# EAGLE design device (EAGLE 9.5.1)
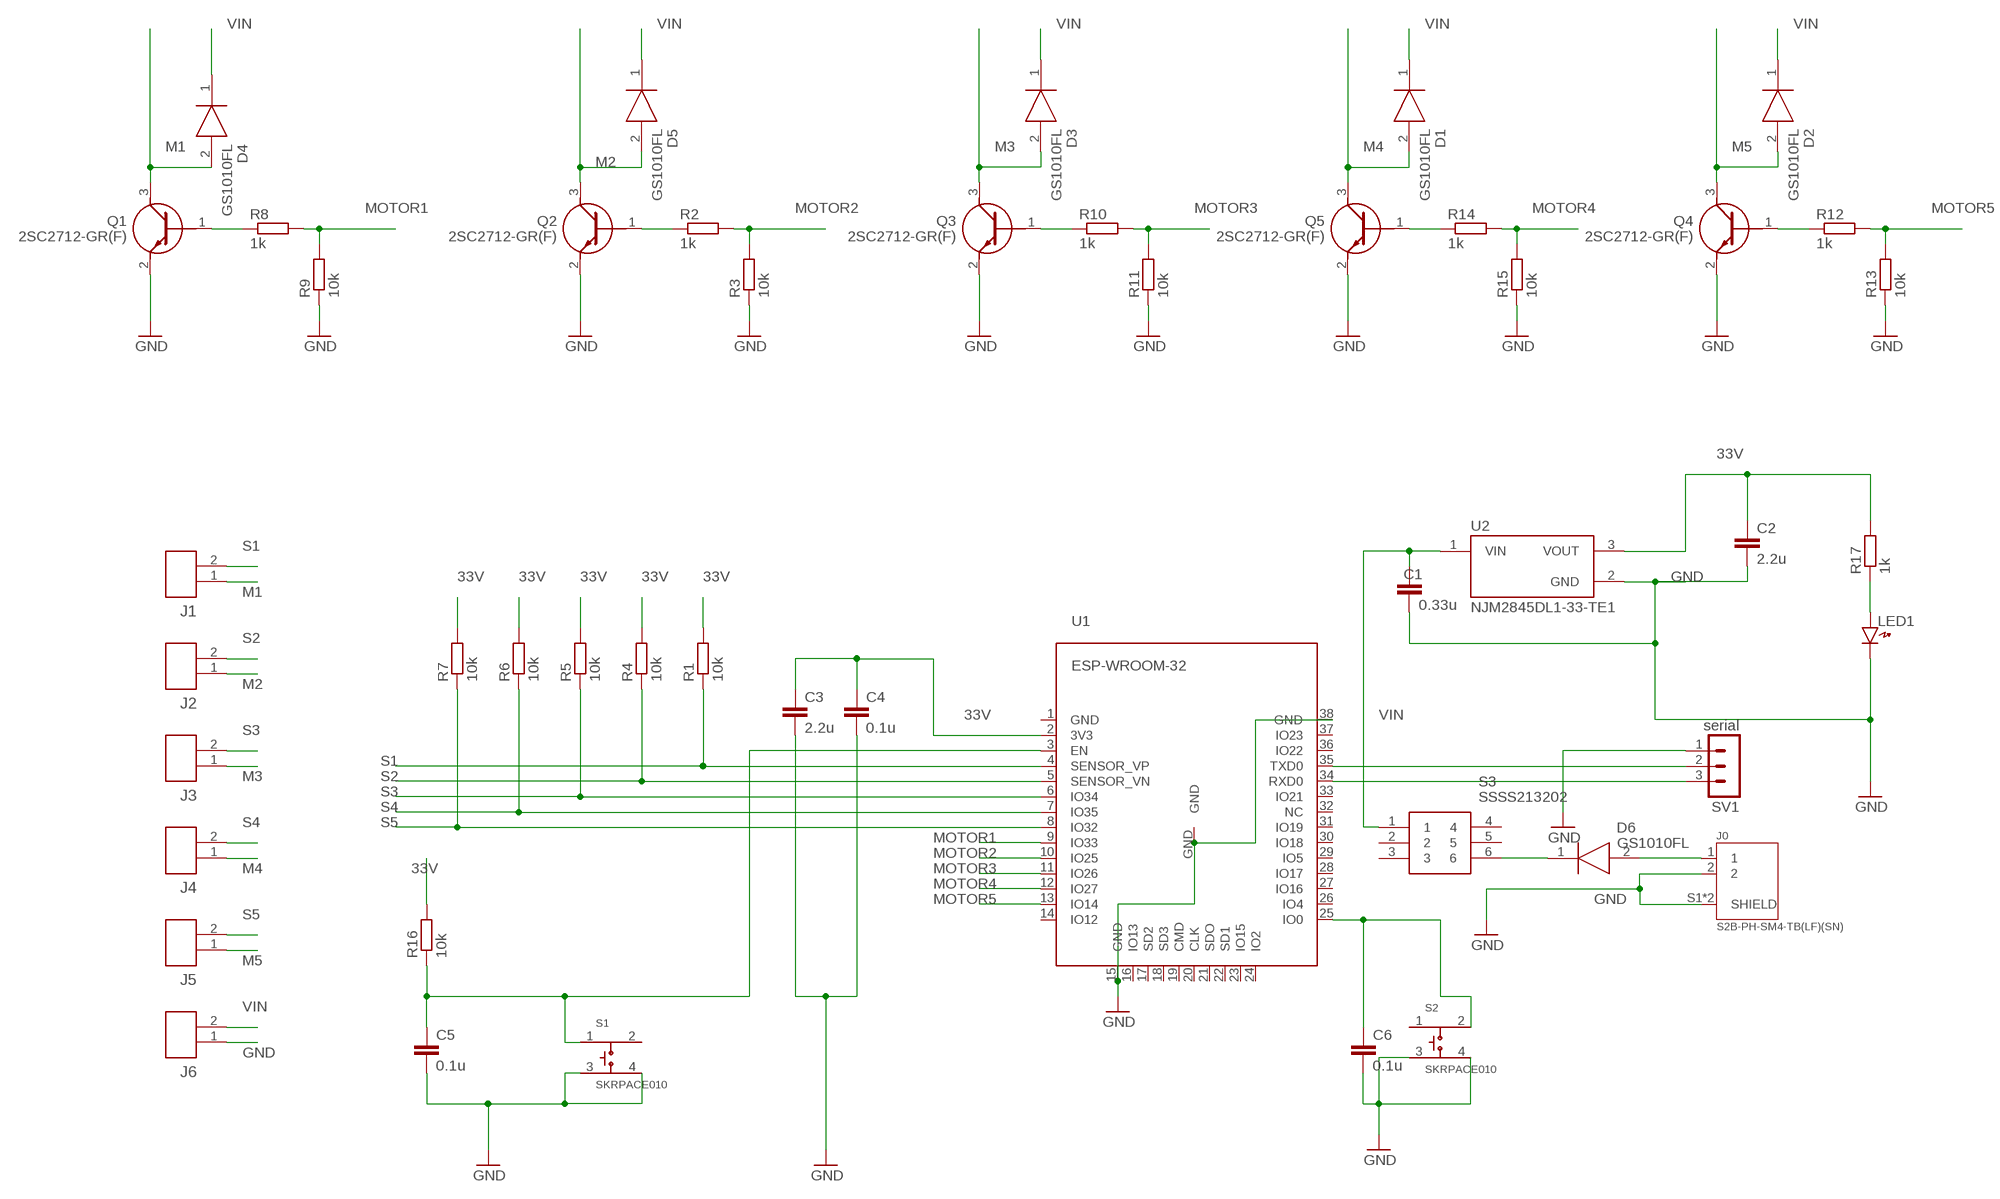
[diagram p0: schematic, sheet 1]

## Parts
C1  0.33u  C-EU025-024X044  [C025-024X044]
C2  2.2u  C-EUC0402  [C0402]
C3  2.2u  C-EUC0402  [C0402]
C4  0.1u  C-EUC0402  [C0402]
C5  0.1u  C-EUC0402  [C0402]
C6  0.1u  C-EUC0402  [C0402]
D1  GS1010FL  [SODFL3618X110N]
D2  GS1010FL  [SODFL3618X110N]
D3  GS1010FL  [SODFL3618X110N]
D4  GS1010FL  [SODFL3618X110N]
D5  GS1010FL  [SODFL3618X110N]
D6  GS1010FL  [SODFL3618X110N]
J0  S2B-PH-SM4-TB(LF)(SN)  [JST_S2B-PH-SM4-TB(LF)(SN)]
J1  JST_ZH_2PIN  [JST_ZH_2PIN]
J2  JST_ZH_2PIN  [JST_ZH_2PIN]
J3  JST_ZH_2PIN  [JST_ZH_2PIN]
J4  JST_ZH_2PIN  [JST_ZH_2PIN]
J5  JST_ZH_2PIN  [JST_ZH_2PIN]
J6  JST_ZH_2PIN  [JST_ZH_2PIN]
LED1  LED1608  [LED1608]
Q1  2SC2712-GR(F)  [SC-59]
Q2  2SC2712-GR(F)  [SC-59]
Q3  2SC2712-GR(F)  [SC-59]
Q4  2SC2712-GR(F)  [SC-59]
Q5  2SC2712-GR(F)  [SC-59]
R1  10k  R-EU_R0603  [R0603]
R2  1k  R-EU_R0603  [R0603]
R3  10k  R-EU_R0603  [R0603]
R4  10k  R-EU_R0603  [R0603]
R5  10k  R-EU_R0603  [R0603]
R6  10k  R-EU_R0603  [R0603]
R7  10k  R-EU_R0603  [R0603]
R8  1k  R-EU_R0603  [R0603]
R9  10k  R-EU_R0603  [R0603]
R10  1k  R-EU_R0603  [R0603]
R11  10k  R-EU_R0603  [R0603]
R12  1k  R-EU_R0603  [R0603]
R13  10k  R-EU_R0603  [R0603]
R14  1k  R-EU_R0603  [R0603]
R15  10k  R-EU_R0603  [R0603]
R16  10k  R-EU_R0603  [R0603]
R17  1k  R-EU_R0603  [R0603]
S1  SKRPACE010  [SW_SKRPACE010]
S2  SKRPACE010  [SW_SKRPACE010]
S3  SSSS213202  [SSSS213202]
SV1  serial  MA03-1  [MA03-1]
U1  ESP-WROOM-32  [ESP-WROOM-32]
U2  NJM2845DL1-33-TE1  [DPAK228P968X238-4N]

## Nets
33V: C2.1 C3.1 C4.1 R1.2 R4.2 R5.2 R6.2 R7.2 R16.2 R17.2 U1.2(3V3) U2.3(VOUT)
GND: C1.2 C2.2 C3.2 C4.2 C5.2 C6.2 J0.2 J0.S1(SHIELD) J0.S2(SHIELD) J6.1 LED1.K Q1.2(E) Q2.2(E) Q3.2(E) Q4.2(E) Q5.2(E) R3.1 R9.1 R11.1 R13.1 R15.1 S1.3 S1.4 S2.3 S2.4 SV1.1 U1.15(GND) U1.38(GND) U1.GND U2.2(GND)
M1: D4.2(A) J1.1 Q1.3(C)
M2: D5.2(A) J2.1 Q2.3(C)
M3: D3.2(A) J3.1 Q3.3(C)
M4: D1.2(A) J4.1 Q5.3(C)
M5: D2.2(A) J5.1 Q4.3(C)
MOTOR1: R8.2 R9.2 U1.9(IO33)
MOTOR2: R2.2 R3.2 U1.10(IO25)
MOTOR3: R10.2 R11.2 U1.11(IO26)
MOTOR4: R14.2 R15.2 U1.12(IO27)
MOTOR5: R12.2 R13.2 U1.13(IO14)
N$1: C5.1 R16.1 S1.1 U1.3(EN)
N$2: Q2.1(B) R2.1
N$3: C6.1 S2.2 U1.25(IO0)
N$4: SV1.2 U1.35(TXD0)
N$5: SV1.3 U1.34(RXD0)
N$6: Q3.1(B) R10.1
N$7: LED1.A R17.1
N$8: D6.1(K) S3.6
N$9: Q1.1(B) R8.1
N$10: Q4.1(B) R12.1
N$11: Q5.1(B) R14.1
N$12: D6.2(A) J0.1
S1: J1.2 R1.1 U1.4(SENSOR_VP)
S2: J2.2 R4.1 U1.5(SENSOR_VN)
S3: J3.2 R5.1 U1.6(IO34)
S4: J4.2 R6.1 U1.7(IO35)
S5: J5.2 R7.1 U1.8(IO32)
VIN: C1.1 D1.1(K) D2.1(K) D3.1(K) D4.1(K) D5.1(K) J6.2 S3.1 U2.1(VIN)
Unconnected: S1.2 S2.1 S3.2 S3.3 S3.4 S3.5 U1.1(GND) U1.14(IO12) U1.16(IO13) U1.17(SD2) U1.18(SD3) U1.19(CMD) U1.20(CLK) U1.21(SDO) U1.22(SD1) U1.23(IO15) U1.24(IO2) U1.26(IO4) U1.27(IO16) U1.28(IO17) U1.29(IO5) U1.30(IO18) U1.31(IO19) U1.32(NC) U1.33(IO21) U1.36(IO22) U1.37(IO23)

## Library data of the parts
C1-C6 = rcl:C-EU: CAPACITOR, European symbol; SPICEPREFIX: C
D1-D6 = GS1010FL:GS1010FL: Surface general purpose rectifier Source: Datasheet <http://www.panjit.com.tw/pdf/GPP/GS1000FL_SERIES 170613 REV.07.pdf>; DESCRIPTION: Surface general purpose rectifier; HEIGHT: 1.1mm; MANUFACTURER_NAME: PANJIT; MANUFACTURER_PART_NUMBER: GS1010FL
J0 = S2B-PH-SM4-TB_LF__SN_:S2B-PH-SM4-TB(LF)(SN): PH Series 2 Position 2 mm Pitch Surface Mount Side Entry Shrouded Header; DESCRIPTION: PH Series 2 Position 2 mm Pitch Surface Mount Side Entry Shrouded Header; DIGI-KEY_PART_NUMBER: 455-1749-1-ND; DIGI-KEY_PURCHASE_URL: https://www.digikey.com/product-detail/en/jst-sales-america-inc/S2B-PH-SM4-TB_LF__SN_/455-1749-1-ND/926846?utm_source=snapeda&utm_medium=aggregator&utm_campaign=symbol; MF: JST Sales; MP: S2B-PH-SM4-TB_LF__SN_; PACKAGE: None
J1-J6 = kanflo:JST_ZH_2PIN: JST ZH connector, 2 pins ZH has 1.5mm spacing. Datasheet <http://www.jst-mfg.com/product/pdf/eng/eZH.pdf>
LED1 = generic:LED: Generic LEDs
Q1-Q5 = 2SC2712-GR(F):2SC2712-GR(F): Vceo50V,Ic0.15A,Vce(sat)0.25V,hfe200to40 Toshiba 2SC2712-GR(F) NPN Bipolar Transistor, 0.15 A, 50 V, 3-Pin SC-59 Source: Datasheet <https://toshiba.semicon-storage.com/ap-en/product/bipolar-transistor/bipolar-transistor/detail.2SC2712.html>; DESCRIPTION: Vceo50V,Ic0.15A,Vce(sat)0.25V,hfe200to40 Toshiba 2SC2712-GR(F) NPN Bipolar Transistor, 0.15 A, 50 V, 3-Pin SC-59; HEIGHT: mm; MANUFACTURER_NAME: Toshiba; MANUFACTURER_PART_NUMBER: 2SC2712-GR(F); RS_PART_NUMBER: 5319309; RS_PRICE-STOCK: http://uk.rs-online.com/web/p/products/5319309
R1-R17 = rcl:R-EU_: RESISTOR, European symbol; SPICEPREFIX: R
S1 S2 = SKRPACE010:SKRPACE010: Switch Tactile N.O. SPST Button J-Bend 0.05A 16VDC 2.55N SMD Automotive T/R; AVAILABILITY: Unavailable; DESCRIPTION: Switch Tactile N.O. SPST Button J-Bend 0.05A 16VDC 2.55N SMD Automotive T/R; MF: ALPS; MP: SKRPACE010; PACKAGE: None; PRICE: None
S3 = SSSS213202:SSSS213202: Slide Switches 1-pole 2-positions Surface Mount Slide Switch SPDT Maintained 0.3 A Slide Source: Datasheet <http://www.alps.com/prod/info/E/HTML/Switch/Slide/SSSS2/SSSS213202.html#Land Dimensions>; DESCRIPTION: Slide Switches 1-pole 2-positions Surface Mount Slide Switch SPDT Maintained 0.3 A Slide; HEIGHT: mm; MANUFACTURER_NAME: ALPS; MANUFACTURER_PART_NUMBER: SSSS213202; MOUSER_PART_NUMBER: 688-SSSS213202; MOUSER_PRICE-STOCK: https://www.mouser.com/Search/Refine.aspx?Keyword=688-SSSS213202; RS_PART_NUMBER: 1238917; RS_PRICE-STOCK: http://uk.rs-online.com/web/p/products/1238917
SV1 = con-lstb:MA03-1: PIN HEADER; OC_FARNELL: unknown; OC_NEWARK: unknown
U1 = esp32:ESP-WROOM-32
U2 = NJM2845DL1-33-TE1:NJM2845DL1-33-TE1: NJM2845 Series 800 mA 3.3 V Fixed Output SMT LDO Regulator - TO-252; AVAILABILITY: Unavailable; DESCRIPTION: NJM2845 Series 800 mA 3.3 V Fixed Output SMT LDO Regulator - TO-252; MF: NJR Corporation/NJRC; MP: NJM2845DL1-33-TE1; PACKAGE: TO-252-3 New Japan Radio; PRICE: None

## Board
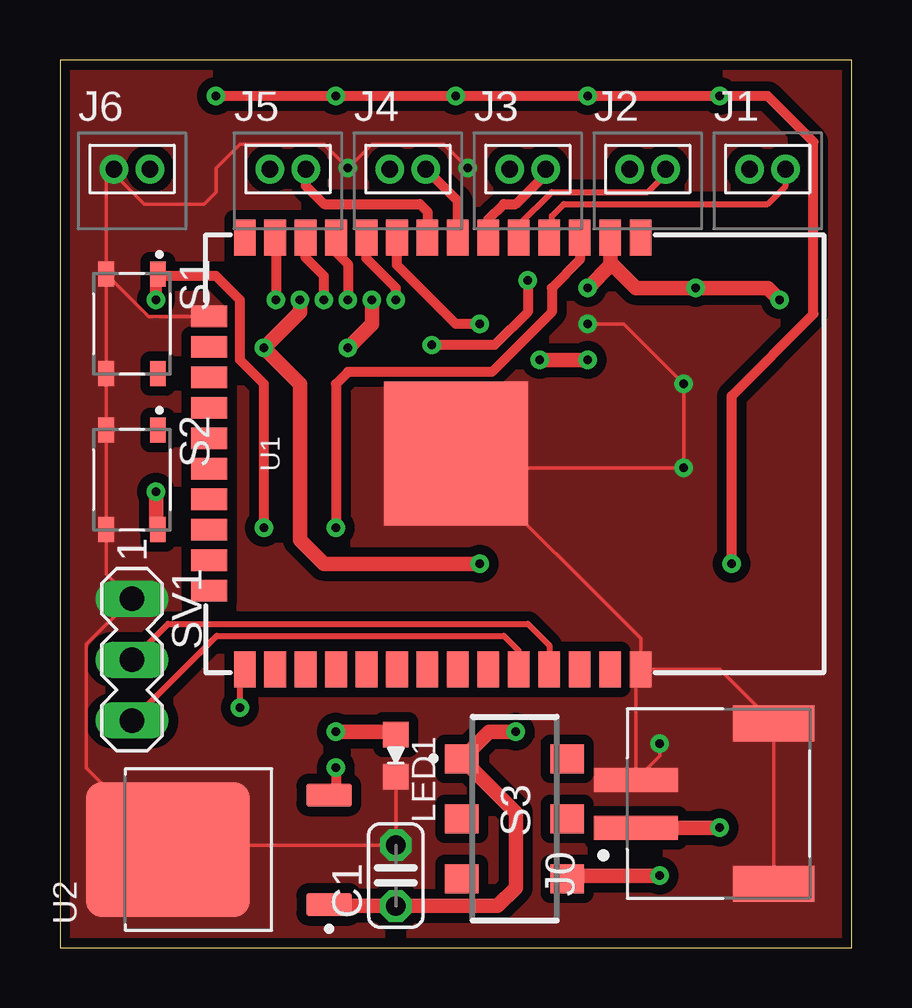
[diagram p1: board, top side]
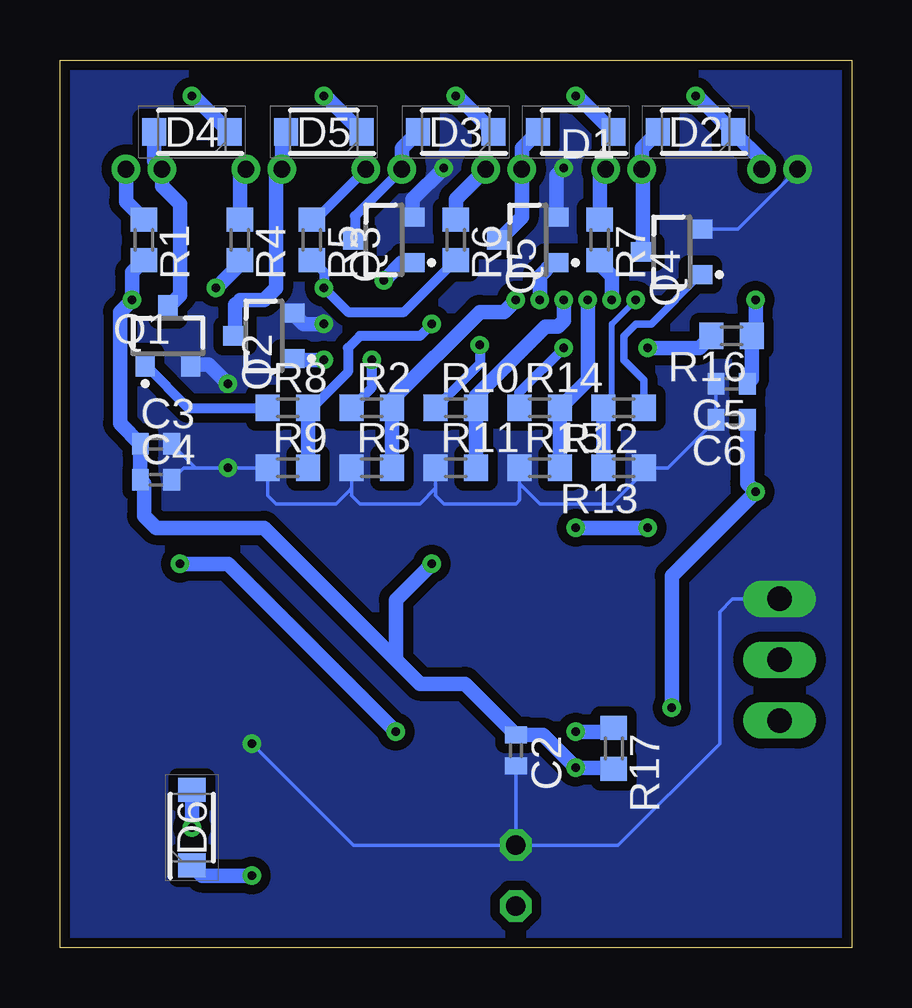
[diagram p2: board, bottom side, seen from below]

Size 33 x 37 mm. Coordinates in mm from the lower left corner, seen from the top.
Outline: 0,0 33,0 33,37 0,37 0,0
Copper layers (1*16): Top 0.035mm / dielectric 1.5mm / Bottom 0.035mm
Design rules "PCBGoGo": minimum track width 6mil, minimum drill 0.2mm, track to track 6mil, track to pad 6mil, pad to pad 6mil, via to via 6mil, smd to smd 6mil, copper to edge 0.2mm, drill to drill 6mil, minimum pad ring 10mil, minimum via ring 8mil, stop-mask expansion 4mil, vias tented up to drill 0mil, thermal gap 10mil

### Footprints (pad centres in the part's own frame; a part is rotated, then mirrored left to right if it is on the bottom)
C025-024X044 = drill 0.813 octagon: 1 -1.27,0; 2 1.27,0
C0402 = smd 0.7 x 0.9: 1 -0.65,0; 2 0.65,0
SODFL3618X110N = smd 1 x 1.13: 1 -1.575,0; 2 1.575,0
JST_S2B-PH-SM4-TB(LF)(SN) = smd 1 x 3.5: 1 -1,0; 2 1,0 | smd 1.5 x 3.4: S1 -3.35,-5.75; S2 3.35,-5.75
JST_ZH_2PIN = drill 0.7 pad 1: 1 -0.75,0.45; 2 0.75,0.45
LED1608 = smd 1.05 x 1.08: A -0.875,0; K 0.875,0
SC-59 = smd 0.8 x 1: 1 -0.95,-1.2; 2 0.95,-1.2; 3 0,1.2
R0603 = smd 1 x 1.1: 1 -0.85,0; 2 0.85,0
SW_SKRPACE010 = smd 1.05 x 0.65: 1 -2.075,1.075; 2 2.075,1.075; 3 -2.075,-1.075; 4 2.075,-1.075
SSSS213202 = smd 1.2 x 1.4: 1 -2.5,-2.2; 2 0,-2.2; 3 2.5,-2.2; 4 -2.5,2.2; 5 0,2.2; 6 2.5,2.2
MA03-1 = drill 1.016 long: 1 -2.54,0; 2 0,0; 3 2.54,0
ESP-WROOM-32 = smd 0.9 x 1.5: 1 7.7,9; 2 6.43,9; 3 5.16,9; 4 3.89,9; 5 2.62,9; 6 1.35,9; 7 0.08,9; 8 -1.19,9; 9 -2.46,9; 10 -3.73,9; 11 -5,9; 12 -6.27,9; 13 -7.54,9; 14 -8.81,9; 25 -8.81,-9; 26 -7.54,-9; 27 -6.27,-9; 28 -5,-9; 29 -3.73,-9; 30 -2.46,-9; 31 -1.19,-9; 32 0.08,-9; 33 1.35,-9; 34 2.62,-9; 35 3.89,-9; 36 5.16,-9; 37 6.43,-9; 38 7.7,-9 | smd 1.5 x 0.9: 15 -10.3,5.715; 16 -10.3,4.445; 17 -10.3,3.175; 18 -10.3,1.905; 19 -10.3,0.635; 20 -10.3,-0.635; 21 -10.3,-1.905; 22 -10.3,-3.175; 23 -10.3,-4.445; 24 -10.3,-5.715 | smd 6 x 6: GND 0,0
DPAK228P968X238-4N = smd 0.96 x 1.9: 1 -2.28,-4.59; 3 2.28,-4.59 | smd 5.63 x 6.84: 2 0,2.12

### Placement (x,y rotation side)
C1  14,3 90 top
C2  13.99,8.22 270 bottom
C3  29,21 0 bottom
C4  29,19.5 0 bottom
C5  5,23.5 180 bottom
C6  5,22 180 bottom
D1  11.5,34 180 bottom
D2  6.5,34 180 bottom
D3  16.5,34 180 bottom
D4  27.5,34 180 bottom
D5  22,34 180 bottom
D6  27.5,5 90 bottom
J0  24,6 90 top
J1  29.5,32 0 top
J2  24.5,32 0 top
J3  19.5,32 0 top
J4  14.5,32 0 top
J5  9.5,32 0 top
J6  3,32 0 top
LED1  14,8 270 top
Q1  28.5,25.5 0 bottom
Q2  24.5,25.5 90 bottom
Q3  19.5,29.5 90 bottom
Q4  7.5,29 90 bottom
Q5  13.5,29.5 90 bottom
R1  29.5,29.5 270 bottom
R2  20,22.5 0 bottom
R3  20,20 0 bottom
R4  25.5,29.5 270 bottom
R5  22.5,29.5 270 bottom
R6  16.5,29.5 270 bottom
R7  10.5,29.5 270 bottom
R8  23.5,22.5 0 bottom
R9  23.5,20 0 bottom
R10  16.5,22.5 0 bottom
R11  16.5,20 0 bottom
R12  9.5,22.5 180 bottom
R13  9.5,20 180 bottom
R14  13,22.5 0 bottom
R15  13,20 0 bottom
R16  5,25.5 180 bottom
R17  9.91,8.3 270 bottom
S1  3,26 270 top
S2  3,19.5 270 top
S3  18.95,5.37 270 top
SV1  3,12 270 top
U1  16.51,20.59 0 top
U2  6.62,4.08 90 top

### Tracks (layer width: path | path; a pad name or v marks a point on that pad's centre or on a via)
33V  (via drill 0.35)
  Top 0.152: U1.2 22.94,28.44 | 11.5,6.65 U2.3
  Top 0.406: v11.5,7.5 11.5,6.65
  Top 0.61: v30,27 29.5,27.5 v26.5,27.5 24,27.5 22.94,28.56 U1.2 | 22.94,28.44 v22,27.5 | v10,27 10,26.5 v8.5,25 10,23.5 10,17 11,16 v17.5,16
  Bottom 0.152: R7.2 10.5,28.5 | R17.2 9.96,7.5 | C4.1 29.5,19.35
  Bottom 0.406: R5.2 22,28.15 v22,27.5 21,26.5 18.65,26.5 R6.2
  Bottom 0.61: 10.5,28.5 10,28 v10,27 | R1.2 30,28.15 v30,27 30.5,26.5 30.5,21.85 C3.1 C4.1 | v26.5,27.5 25.5,28.5 R4.2 | v8.5,25 6.35,25 R16.2 | 9.96,7.5 v11.5,7.5 12.87,8.87 C2.1 16.12,11 18,11 19,12 | 29.5,19.35 29.5,18 29,17.5 24.5,17.5 19,12 | v17.5,16 19,14.5 19,12
GND  (via drill 0.35)
  Top 0.152: LED1.K C1.2 4.69,4.27 U2.2 1.09,7.49 1.09,12.63 SV1.1 2.96,14.54 1.93,15.57 S2.4 S2.3 S1.4 S1.3 | U1.38 24,11.38 J0.2 25,8 v25,8.5 | S1.3 1.93,32.12 J6.1 2.25,32.25 3.5,31 6,31 6.5,31.5 6.5,32.5 7.5,33.5 11,33.5 v12,32.5 13,33.5 16,33.5 v17,32.5 | S1.3 3.69,26.3 U1.15 | 17.1,20 24.21,12.89 U1.38 | v22,26 23.5,26 v26,23.5 v26,20 17.1,20 | 17.1,20 U1.GND | U1.38 27.51,11.59 J0.S2 J0.S1
  Bottom 0.152: C5.2 C6.2 7.65,20 8.5,20 | R13.1 8.5,20 | 8.5,20 10,18.5 13,18.5 13.85,19.35 R15.1 13.85,18.65 14,18.5 17,18.5 17.35,18.85 R11.1 17.35,19.15 18,18.5 20.5,18.5 20.85,18.85 20.85,19.15 | Q4.2 4.75,29.95 J6.1 | C3.2 27.35,20 | 27.35,20 v26,20 R9.1 24.35,18.85 24,18.5 21.5,18.5 21,19 20.85,19.15 | C4.2 27.85,20 27.35,20 | C2.2 C1.2 | C1.2 9.73,4.27 5.5,8.5 5.5,14 4.96,14.54 SV1.1 | C1.2 20.77,4.27 v25,8.5 | 20.85,19.15 R3.1
  Bottom 0.61: Q2.2 22.85,26 v22,26 | Q1.2 26.8,24.3 v26,23.5 | Q5.2 12.3,32.2 v12,32.5 | v17,32.5 18.3,31.2 Q3.2
  pour Top (isolate 0.406, no thermals): 0,37 33,37 33,0 0,0 0,36.5
  pour Bottom (isolate 0.406, no thermals): 0.5,37 33,37 33,0 0,0 0,37
M1
  Bottom 0.61: D4.2 29.07,32.77 J1.1 28.75,31.75 28,31 28,27.2 Q1.3
M2
  Bottom 0.152: D5.2 23.75,33.83
  Bottom 0.61: Q2.3 25.7,26.8 25.5,27 24.5,27 24,27.5 24,32.2 J2.1 23.75,33.83
M3
  Bottom 0.406: J3.1 20.7,30.5 Q3.3
  Bottom 0.61: D3.2 18.75,33.33 J3.1
M4
  Bottom 0.61: D1.2 13.75,33.33 J4.1 13.75,30.45 Q5.3
M5
  Bottom 0.152: 8.7,32.4 J5.1
  Bottom 0.61: D2.2 8.75,33.33 J5.1 | Q4.3 8.7,32.4
MOTOR1  (via drill 0.35)
  Top 0.406: v17.5,26 16.5,26 14.05,28.45 U1.9
  Bottom 0.152: 22.5,22.5 R8.2
  Bottom 0.406: v17.5,26 18,25.5 20.5,25.5 21,25 21,24 22.5,22.5
  Bottom 0.61: R8.2 R9.2
MOTOR2  (via drill 0.35)
  Top 0.406: v14,27 14,27.5 12.78,28.72 U1.10
  Bottom 0.152: R2.2 19.15,22.85
  Bottom 0.61: 19.15,22.85 15.5,26.5 14.5,26.5 v14,27 | R2.2 R3.2
MOTOR3  (via drill 0.35)
  Top 0.254: U1.11
  Top 0.406: U1.11 11.5,29 12,28.5 v12,27
  Bottom 0.254: 15.65,23 R10.2
  Bottom 0.61: 15.65,23 12.76,25.89 12.25,25.89 12,26.14 v12,27 | R10.2 R11.2
MOTOR4  (via drill 0.35)
  Top 0.406: v11,27 11,28 10.24,28.76 U1.12
  Bottom 0.61: R15.2 R14.2 11,23.65 v11,27
MOTOR5  (via drill 0.35)
  Top 0.152: U1.13 9,29.56
  Top 0.406: 9,29.56 v9,27
  Bottom 0.152: R12.2 10,22.85
  Bottom 0.254: v9,27 10,26 10,22.85
  Bottom 0.61: R12.2 R13.2
N$1  (via drill 0.35)
  Top 0.305: S1.1 4.15,28
  Top 0.406: 4.15,28 6.5,28 7.5,27 7.5,24.5 8.5,23.5 v8.5,17.5 | v11.5,17.5 11.5,23.5 12,24 18,24 20.5,26.5 20.5,27.5 21.67,28.67 U1.3
  Top 0.508: v4,27 4,27.85 4.15,28
  Bottom 0.152: R16.1 4,25.65 | 4.15,23.7 C5.1
  Bottom 0.61: 4,25.65 v4,27 | R16.1 4.15,23.7 | v11.5,17.5 v8.5,17.5
N$2  (via drill 0.35)
  Top 0.61: v20,24.5 v22,24.5
  Bottom 0.152: Q2.1 23.25,24.5
  Bottom 0.254: 20,23.35 20,23.5
  Bottom 0.406: R2.1 20,23.35 | 20,23.5 20,24 v20,24.5
  Bottom 0.61: v22,24.5 23.25,24.5
N$3  (via drill 0.35)
  Top 0.152: S2.2 4,17.5 | 7.5,11.39 U1.25
  Top 0.254: v7.5,10 7.5,11.39
  Top 0.61: 4,17.5 v4,19
  Bottom 0.61: v7.5,10 7.5,15.5 v4,19 4.35,19.35 C6.1
N$4
  Top 0.254: SV1.2 4.5,13.5 19.5,13.5 20.4,12.6 U1.35
N$5
  Top 0.152: 19.13,12.37 U1.34
  Top 0.254: SV1.3 6.54,13 18.5,13 19.13,12.37
N$6  (via drill 0.35)
  Top 0.406: v19.5,27.81 19.5,26.5 18.12,25.12 v15.5,25.12
  Bottom 0.254: Q3.1 18.76,28.55
  Bottom 0.406: v15.5,25.12 15.5,24.35 R10.1
  Bottom 0.61: 18.76,28.55 v19.5,27.81
N$7  (via drill 0.35)
  Top 0.152: LED1.A 13.88,9
  Top 0.61: 13.88,9 v11.5,9
  Bottom 0.152: 10.06,9 R17.1
  Bottom 0.61: v11.5,9 10.06,9
N$8  (via drill 0.35)
  Top 0.152: 21.28,3 S3.6
  Top 0.61: v25,3 21.28,3
  Bottom 0.61: D6.1 27.07,3 v25,3
N$9
  Bottom 0.406: Q1.1 27.65,22.5 R8.1
N$10
  Bottom 0.305: R12.1 8.65,23.65 9.5,24.5 9.5,25.5 9,26 8.35,26 Q4.1
N$11  (via drill 0.35)
  Top 0.61: v12,25 13,26 v13,27
  Bottom 0.254: 12.45,28.55 Q5.1
  Bottom 0.406: R14.1 13.85,23.15 v12,25
  Bottom 0.61: v13,27 13,28 12.45,28.55
N$12  (via drill 0.35)
  Top 0.61: J0.1 v27.5,5
  Bottom 0.61: D6.2 v27.5,5
S1
  Top 0.152: U1.4 20.5,29.69
  Top 0.254: 20.5,29.69 20.5,30.5 21,31 29.5,31 30.25,31.75 J1.2
  Bottom 0.61: J1.2 30.25,31.1 R1.1
S2
  Top 0.152: J2.2 25.25,32.25
  Top 0.254: U1.5 19.13,30.13 20.5,31.5 24.5,31.5 25.25,32.25
  Bottom 0.61: J2.2 25.5,32.2 R4.1
S3
  Top 0.152: 20.25,32.25 J3.2
  Top 0.406: U1.6 17.86,30.36 18.5,31 19,31 20.25,32.25
  Bottom 0.152: 22.35,30.35 R5.1
  Bottom 0.406: J3.2 22.35,30.35
S4
  Top 0.406: U1.7 16.59,31.11 J4.2
  Bottom 0.61: J4.2 16.5,31.2 R6.1
S5
  Top 0.406: J5.2 10.25,31.75 11,31 15,31 15.32,30.68 U1.8
  Bottom 0.61: J5.2 10.5,32.2 R7.1
VIN  (via drill 0.35)
  Top 0.152: 11.28,1.73 U2.1
  Top 0.406: v6.5,35.5 v11.5,35.5 v16.5,35.5 v22,35.5 v27.5,35.5 29.5,35.5 31.41,33.59 31.41,26.41 28,23 v28,16
  Top 0.61: 11.28,1.73 C1.1 18.23,1.73 19,2.5 19,5.62 S3.1 17.88,9 v19,9
  Bottom 0.254: v6.5,35.5 6.42,35.5
  Bottom 0.305: v27.5,35.5 27.43,35.5 | v22,35.5 21.93,35.5 | v16.5,35.5 16.43,35.5 | v11.5,35.5 11.43,35.5
  Bottom 0.61: D4.1 27.43,35.5 | 21.93,35.5 D5.1 | 16.43,35.5 D3.1 | 11.43,35.5 D1.1 | 6.42,35.5 D2.1 3.75,32.83 J6.2 | v19,9 26,16 v28,16

### Text on the board
Document: M S | M S | M S | M S | M S | GND | TX | RX